# EAGLE design rita_milton_civ (EAGLE 9.6.2)
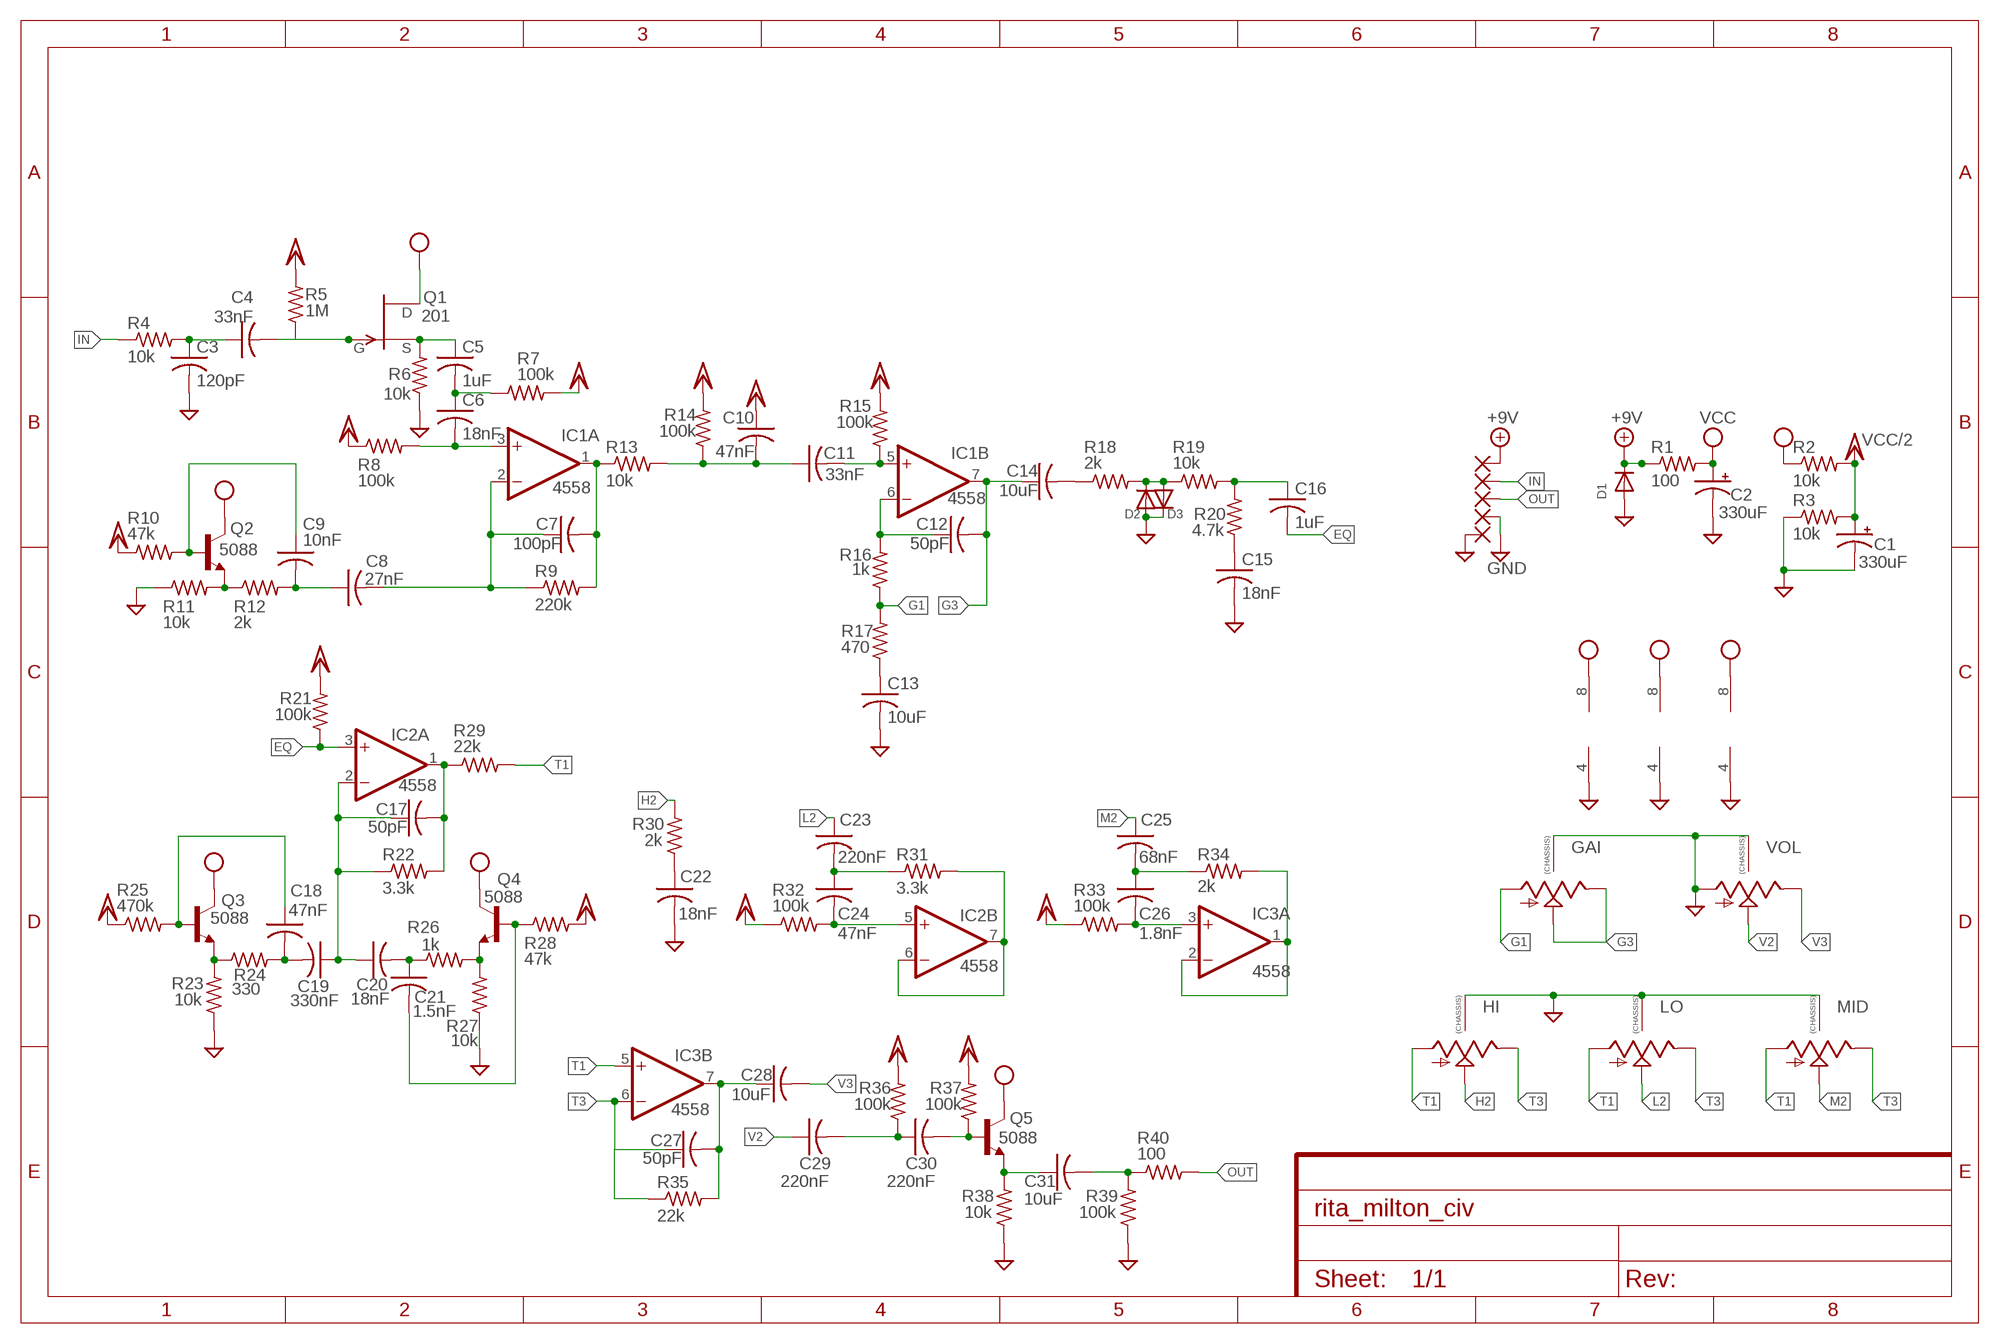
[diagram p0: schematic, sheet 1]

## Parts
C1  330uF  0801  [080_035]
C2  330uF  0801  [080_035]
C3  120pF  C-USC0603  [C0603]
C4  33nF  C-USC0603  [C0603]
C5  1uF  C-USC0805  [C0805]
C6  18nF  C-USC0603  [C0603]
C7  100pF  C-USC0603  [C0603]
C8  27nF  C-USC0603  [C0603]
C9  10nF  C-USC0603  [C0603]
C10  47nF  C-USC0603  [C0603]
C11  33nF  C-USC0603  [C0603]
C12  50pF  C-USC0603  [C0603]
C13  10uF  C-USC1206  [C1206]
C14  10uF  C-USC1206  [C1206]
C15  18nF  C-USC0603  [C0603]
C16  1uF  C-USC0805  [C0805]
C17  50pF  C-USC0603  [C0603]
C18  47nF  C-USC0603  [C0603]
C19  330nF  C-USC0603  [C0603]
C20  18nF  C-USC0603  [C0603]
C21  1.5nF  C-USC0603  [C0603]
C22  18nF  C-USC0603  [C0603]
C23  220nF  C-USC0603  [C0603]
C24  47nF  C-USC0603  [C0603]
C25  68nF  C-USC0603  [C0603]
C26  1.8nF  C-USC0603  [C0603]
C27  50pF  C-USC0603  [C0603]
C28  10uF  C-USC1206  [C1206]
C29  220nF  C-USC0603  [C0603]
C30  220nF  C-USC0603  [C0603]
C31  10uF  C-USC1206  [C1206]
D1  DIODESOD-123  [SOD-123]
D2  DIODESOD-123  [SOD-123]
D3  DIODESOD-123  [SOD-123]
GAI  9MM_SNAP-IN_POT_CHASSIS  [9MM_SNAP-IN_POT]
HI  9MM_SNAP-IN_POT_CHASSIS  [9MM_SNAP-IN_POT]
IC1  4558  LM4558D  [SO08]
IC2  4558  LM4558D  [SO08]
IC3  4558  LM4558D  [SO08]
LO  9MM_SNAP-IN_POT_CHASSIS  [9MM_SNAP-IN_POT]
MID  9MM_SNAP-IN_POT_CHASSIS  [9MM_SNAP-IN_POT]
PAD1  1,6/0,8  [1,6/0,8]
PAD2  1,6/0,8  [1,6/0,8]
PAD3  1,6/0,8  [1,6/0,8]
PAD4  1,6/0,8  [1,6/0,8]
PAD5  1,6/0,8  [1,6/0,8]
Q1  201  SST201  [SOT23]
Q2  5088  TRANSISTOR_NPNMMBT5088  [SOT23]
Q3  5088  TRANSISTOR_NPNMMBT5088  [SOT23]
Q4  5088  TRANSISTOR_NPNMMBT5088  [SOT23]
Q5  5088  TRANSISTOR_NPNMMBT5088  [SOT23]
R1  100  R-US_R0805  [R0805]
R2  10k  R-US_R0603  [R0603]
R3  10k  R-US_R0603  [R0603]
R4  10k  R-US_R0603  [R0603]
R5  1M  R-US_R0603  [R0603]
R6  10k  R-US_R0603  [R0603]
R7  100k  R-US_R0603  [R0603]
R8  100k  R-US_R0603  [R0603]
R9  220k  R-US_R0603  [R0603]
R10  47k  R-US_R0603  [R0603]
R11  10k  R-US_R0603  [R0603]
R12  2k  R-US_R0603  [R0603]
R13  10k  R-US_R0603  [R0603]
R14  100k  R-US_R0603  [R0603]
R15  100k  R-US_R0603  [R0603]
R16  1k  R-US_R0603  [R0603]
R17  470  R-US_R0603  [R0603]
R18  2k  R-US_R0603  [R0603]
R19  10k  R-US_R0603  [R0603]
R20  4.7k  R-US_R0603  [R0603]
R21  100k  R-US_R0603  [R0603]
R22  3.3k  R-US_R0603  [R0603]
R23  10k  R-US_R0603  [R0603]
R24  330  R-US_R0603  [R0603]
R25  470k  R-US_R0603  [R0603]
R26  1k  R-US_R0603  [R0603]
R27  10k  R-US_R0603  [R0603]
R28  47k  R-US_R0603  [R0603]
R29  22k  R-US_R0603  [R0603]
R30  2k  R-US_R0603  [R0603]
R31  3.3k  R-US_R0603  [R0603]
R32  100k  R-US_R0603  [R0603]
R33  100k  R-US_R0603  [R0603]
R34  2k  R-US_R0603  [R0603]
R35  22k  R-US_R0603  [R0603]
R36  100k  R-US_R0603  [R0603]
R37  100k  R-US_R0603  [R0603]
R38  10k  R-US_R0603  [R0603]
R39  100k  R-US_R0603  [R0603]
R40  100  R-US_R0603  [R0603]
VOL  9MM_SNAP-IN_POT_CHASSIS  [9MM_SNAP-IN_POT]

## Nets
+9V: D1.C PAD1.1(P) R1.1
EQ: C16.2 IC2.3(A:+IN) R21.1
G1: GAI.1(A) R16.1 R17.2
G3: C12.2 C14.1 GAI.2(S) GAI.3(E) IC1.7(B:OUT)
GND: C1.- C2.- C3.2 C13.2 C15.2 C22.2 D1.A D2.A D3.C GAI.CHASSIS1 GAI.CHASSIS2 HI.CHASSIS1 HI.CHASSIS2 IC1.4(P:V-) IC2.4(P:V-) IC3.4(P:V-) LO.CHASSIS1 LO.CHASSIS2 MID.CHASSIS1 MID.CHASSIS2 PAD4.1(P) PAD5.1(P) R3.1 R6.1 R11.1 R23.1 R27.1 R38.1 R39.1 VOL.1(A) VOL.CHASSIS1 VOL.CHASSIS2
H2: HI.2(S) R30.2
IN: PAD2.1(P) R4.1
L2: C23.1 LO.2(S)
M2: C25.1 MID.2(S)
N$1: C3.1 C4.1 R4.2
N$2: C4.2 Q1.3(G) R5.1
N$3: C5.1 Q1.2(S) R6.2
N$4: C5.2 C6.1 R7.1
N$5: C6.2 IC1.3(A:+IN) R8.2
N$6: C9.1 Q2.1(B) R10.2
N$7: Q2.2(E) R11.2 R12.1
N$8: C8.1 C9.2 R12.2
N$9: C7.1 C8.2 IC1.2(A:-IN) R9.1
N$10: C7.2 IC1.1(A:OUT) R9.2 R13.1
N$11: C10.2 C11.1 R13.2 R14.1
N$12: C11.2 IC1.5(B:+IN) R15.1
N$13: C12.1 IC1.6(B:-IN) R16.2
N$14: C14.2 R18.1
N$15: D2.C D3.A R18.2 R19.1
N$16: C13.1 R17.1
N$17: C17.1 C19.1 C20.1 IC2.2(A:-IN) R22.1
N$18: C16.1 R19.2 R20.2
N$19: C15.1 R20.1
N$20: C17.2 IC2.1(A:OUT) R22.2 R29.1
N$21: Q3.2(E) R23.2 R24.1
N$22: C18.2 C19.2 R24.2
N$23: C18.1 Q3.1(B) R25.2
N$24: C20.2 C21.1 R26.1
N$25: Q4.2(E) R26.2 R27.2
N$26: C21.2 Q4.1(B) R28.1
N$27: C22.1 R30.1
N$28: C23.2 C24.1 R31.1
N$29: C24.2 IC2.5(B:+IN) R32.2
N$30: IC2.6(B:-IN) IC2.7(B:OUT) R31.2
N$31: C25.2 C26.1 R34.1
N$32: C26.2 IC3.3(A:+IN) R33.2
N$33: IC3.1(A:OUT) IC3.2(A:-IN) R34.2
N$34: C27.2 C28.1 IC3.7(B:OUT) R35.2
N$35: C29.2 C30.1 R36.1
N$36: C30.2 Q5.1(B) R37.1
N$37: C31.1 Q5.2(E) R38.2
N$38: C31.2 R39.2 R40.1
OUT: PAD3.1(P) R40.2
T1: HI.1(A) IC3.5(B:+IN) LO.1(A) MID.1(A) R29.2
T3: C27.1 HI.3(E) IC3.6(B:-IN) LO.3(E) MID.3(E) R35.1
V2: C29.1 VOL.2(S)
V3: C28.2 VOL.3(E)
VCC: C2.+ IC1.8(P:V+) IC2.8(P:V+) IC3.8(P:V+) Q1.1(D) Q2.3(C) Q3.3(C) Q4.3(C) Q5.3(C) R1.2 R2.1
VCC/2: C1.+ C10.1 R2.2 R3.2 R5.2 R7.2 R8.1 R10.1 R14.2 R15.2 R21.2 R25.1 R28.2 R32.1 R33.1 R36.2 R37.2

## Library data of the parts
C1 C2 = capacitors-elec:080: 47 - 470uF Xicon values at Mouser.com 10V: 330, 470uF; 16V: 220, 330uF; 25V: 220uF; 50V: 47, 100uF
C3-C31 = adafruit:C-US: CAPACITOR, American symbol
D1-D3 = adafruit:DIODE: Diode SMADIODE - SMA Surface Mount Package 20V 1A Schottky Diode Digikey: 641-1014-6-ND DO-1N4148 - Through Hole Small Current Diode SOD-123 20V 1 A (.5mV Vf) Schottky Diode - Digikey: MBRX120TPMSCT-ND SOD-323 10V 570mA (.38mV Vf, 3ns) Schottky Diode - Digikey: ZLLS410CT-ND SOD-523 30V 30mA Schottky Diode (RB751S-40TE61) - Digikey: RB751S-40TE61CT-ND SOT23-R/W - SOT23 Package (R = Solder Paste/Reflow Ovens, W = Hand-Soldering) BAT54Film 40V 300mA - Digikey: 497-7162-1-ND
GAI HI LO MID VOL = MusicThingModular:9MM_SNAP-IN_POT_CHASSIS: 9mm vertical snap-in pot, Alpha / Panasonic style, with a connection to the metal chassis for grounding
IC1-IC3 = linear:*4558: OP AMP
PAD1-PAD5 = wirepad:1,6/0,8: THROUGH-HOLE PAD
Q1 = transistor-fet:?20*: TEMIC / Siliconix N-Channel JFET Source: JFET-J201_Siliconix_data.pdf
Q2-Q5 = SparkFun-DiscreteSemi:TRANSISTOR_NPN: Generic NPN BJT MMBT2222A - TRANS-08049 (SOT-23, 1A 40V) MPSA42 - TRANS-09116 (SOT-23, 500mA 300V) MMBT5088LT1G - TRANS-11160 (SOT-23, 50 mA 30V) BC547 - COM-08928 <http://www.sparkfun.com/products/8928> (TO-92 45V 100mA) (1.Collector 2.Base 3.Emitter) 2N3904 - COM-00521 <http://www.sparkfun.com/products/521> (TO-92 40V 200mA) (1.Emitter 2.Base 3.Collector) P2N2222A - COM-12852 <http://www.sparkfun.com/products/12852> (TO-92 40V 600mA) (1.Collector 2.Base 3.Emitter); PROD_ID: TRANS-11160; VALUE: MMBT5088
R1-R40 = adafruit:R-US_: RESISTOR, American symbol

## Board
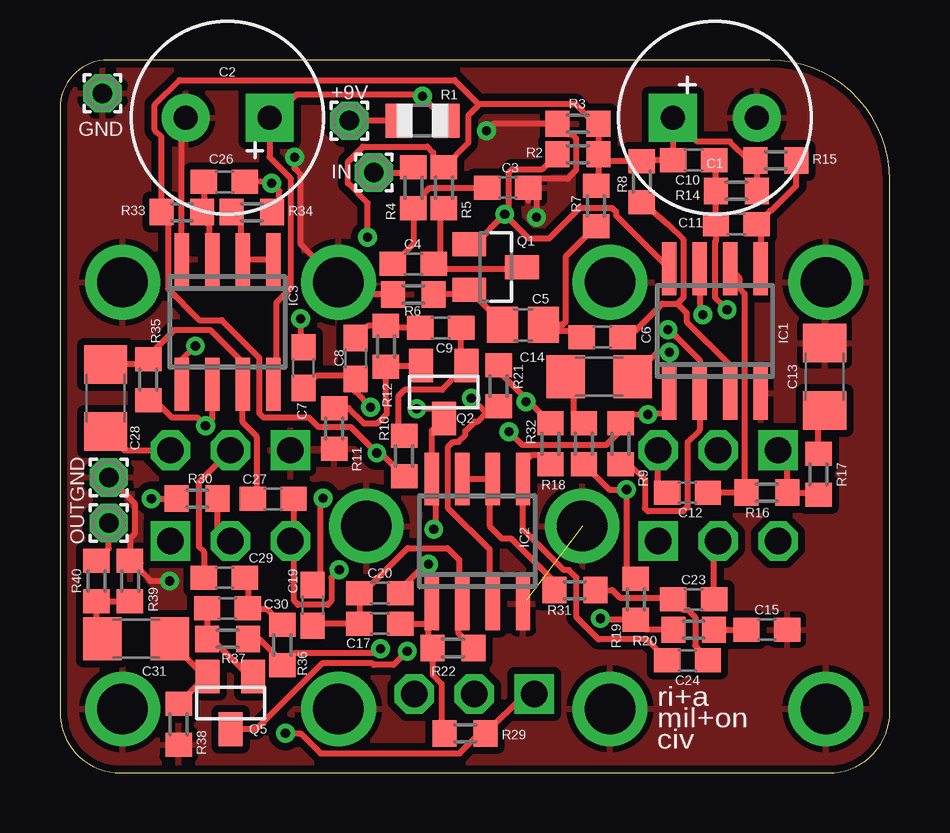
[diagram p1: board, top side]
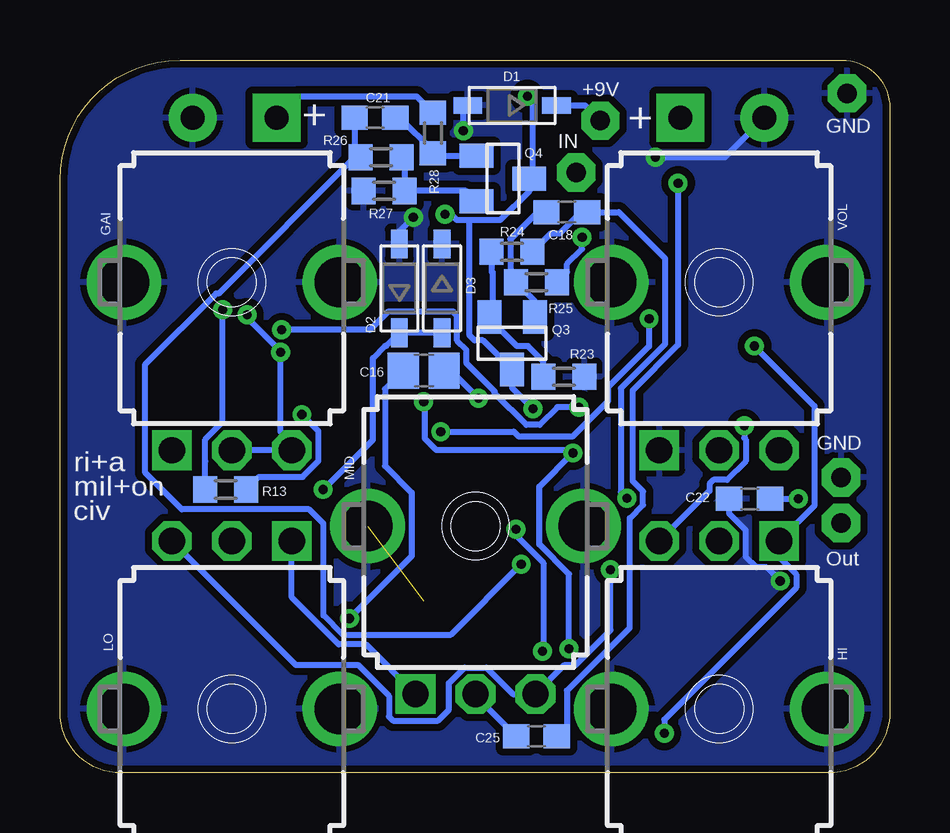
[diagram p2: board, bottom side, seen from below]

Size 34.59 x 29.71 mm. Coordinates in mm from the lower left corner, seen from the top.
Outline: 29.59,29.71 2,29.71 arc90 0,27.71 0,2.54 arc90 2.54,0 32.05,0 arc90 34.59,2.54 34.59,24.71 arc90 29.59,29.71
Copper layers (1*16): Top 0.035mm / dielectric 1.5mm / Bottom 0.035mm
Design rules "default *": minimum track width 6mil, minimum drill 0.35mm, track to track 6mil, track to pad 6mil, pad to pad 6mil, via to via 6mil, smd to smd 6mil, copper to edge 10mil, drill to drill 6mil, minimum pad ring 10mil, minimum via ring 8mil, stop-mask expansion 4mil, vias tented up to drill 0mil, thermal gap 10mil

### Footprints (pad centres in the part's own frame; a part is rotated, then mirrored left to right if it is on the bottom)
080_035 = drill 1 pad 2 square: + -1.75,0 | drill 1 pad 2: - 1.75,0
C0603 = smd 1.1 x 1: 1 -0.85,0; 2 0.85,0
C0805 = smd 1.3 x 1.5: 1 -0.85,0; 2 0.85,0
C1206 = smd 1.6 x 1.8: 1 -1.4,0; 2 1.4,0
SOD-123 = smd 1.2 x 0.7: A 1.85,0; C -1.85,0
9MM_SNAP-IN_POT = drill 1.1 square: 1 -2.5,-7 | drill 1.1 octagon: 2 0,-7; 3 2.5,-7 | drill 2.1 pad 2.794: CHASSIS1 -4.5,0; CHASSIS2 4.5,0
SO08 = smd 0.6 x 2.2: 1 -1.905,-2.6; 2 -0.635,-2.6; 3 0.635,-2.6; 4 1.905,-2.6; 5 1.905,2.6; 6 0.635,2.6; 7 -0.635,2.6; 8 -1.905,2.6
1,6/0,8 = drill 0.813 pad 1.6 octagon: 1 0,0
SOT23 = smd 1 x 1.4: 1 -0.95,-1.1; 2 0.95,-1.1; 3 0,1.1
R0805 = smd 1.1 x 1.4: 1 -1,0; 2 1,0
R0603 = smd 1 x 1.1: 1 -0.85,0; 2 0.85,0

### Placement (x,y rotation side)
C1  27.3,27.3 0 top
C2  6.99,27.3 180 top
C3  18.67,24.38 0 top
C4  14.73,21.21 0 top
C5  19.3,18.67 0 top
C6  22.61,18.16 0 top
C7  10.16,16.89 90 top
C8  12.32,17.27 270 top
C9  15.88,18.54 180 top
C10  26.42,25.53 0 top
C11  28.19,22.86 0 top
C12  26.16,11.68 180 top
C13  31.88,16.51 90 top
C14  22.48,16.51 180 top
C15  29.46,5.97 0 top
C16  19.43,16.76 0 bottom
C17  13.34,6.22 0 top
C18  13.46,23.37 0 bottom
C19  10.54,6.99 90 top
C20  13.34,7.49 0 top
C21  21.46,27.3 0 bottom
C22  5.84,11.43 180 bottom
C23  26.42,7.24 180 top
C24  26.16,4.7 180 top
C25  14.73,1.52 0 bottom
C26  6.86,24.64 180 top
C27  8.89,11.43 180 top
C28  1.91,15.62 270 top
C29  6.86,8.13 0 top
C30  6.99,6.86 180 top
C31  3.17,5.59 180 top
D1  15.75,27.81 180 bottom
D2  20.45,20.19 90 bottom
D3  18.67,20.19 270 bottom
GAI  27.43,20.45 0 bottom
HI  7.11,2.67 180 bottom
IC1  27.3,18.41 0 top
IC2  17.4,9.65 0 top
IC3  6.99,18.8 180 top
LO  27.43,2.67 180 bottom
MID  17.27,10.29 0 bottom
PAD1  12.06,27.18 0 top
PAD2  13.08,25.02 0 top
PAD3  2.03,10.41 0 top
PAD4  1.78,28.32 0 top
PAD5  2.03,12.32 0 top
Q1  18.16,21.08 270 top
Q2  16,15.88 180 top
Q3  15.75,17.91 180 bottom
Q4  16.13,24.77 270 bottom
Q5  7.11,2.92 180 top
R1  15.11,27.18 0 top
R2  21.59,25.78 0 top
R3  21.59,27.05 0 top
R4  14.73,24.38 270 top
R5  16,24.38 90 top
R6  14.73,19.94 0 top
R7  22.35,23.62 90 top
R8  24.26,24.64 270 top
R9  23.37,13.72 90 top
R10  14.35,13.21 90 top
R11  11.43,14.35 90 top
R12  13.59,17.78 90 top
R13  27.69,11.81 180 bottom
R14  28.19,24.26 0 top
R15  29.84,25.53 180 top
R16  29.46,11.68 180 top
R17  31.62,12.45 270 top
R18  21.84,13.72 270 top
R19  24,7.24 270 top
R20  26.42,5.97 180 top
R21  18.29,16.13 90 top
R22  16.38,5.21 180 top
R23  13.59,16.51 180 bottom
R24  15.75,21.72 0 bottom
R25  14.73,20.45 180 bottom
R26  21.21,25.65 0 bottom
R27  21.08,24.26 0 bottom
R28  19.05,26.67 90 bottom
R29  16.89,1.65 0 top
R30  5.71,11.43 0 top
R31  21.46,7.62 180 top
R32  20.45,13.72 270 top
R33  5.08,23.37 0 top
R34  8,23.37 180 top
R35  3.68,16.38 90 top
R36  9.27,5.33 270 top
R37  6.99,5.59 0 top
R38  4.95,2.03 90 top
R39  2.92,8 270 top
R40  1.52,8 90 top
VOL  7.11,20.45 0 bottom

### Tracks (layer width: path | path; a pad name or v marks a point on that pad's centre or on a via)
+9V
  Top 0.254: R1.1 PAD1.1
  Bottom 0.254: PAD1.1 12.7,27.81 D1.C
EQ  (via drill 0.38)
  Top 0.254: IC2.3 17.91,7.18 17.91,9.31 16.18,11.04 16.18,13.6 16.39,13.8 16.62,13.8 16.9,14.08 16.9,14.25 17.3,14.64 17.4,14.64 17.78,15.03 | R21.1 18.03,15.28 17.78,15.03 | 17.78,15.03 17.74,15.03 v17.14,15.62
  Bottom 0.254: C16.2 18.29,16.76 v17.14,15.62
G1
  Top 0.254: GAI.1 30.31,13.06 R16.1 31.54,11.68 R17.2
G3  (via drill 0.38)
  Top 0.254: C12.2 24.93,12.06 GAI.3 | v26.8,19.09 26.67,19.21 IC1.7 | C14.1 24.89,17.53 v25.4,17.53
  Bottom 0.254: GAI.2 GAI.3 24.93,13.77 25.4,14.24 v25.4,17.53 25.4,17.56 26.8,18.96 v26.8,19.09
GND  (via drill 0.38)  (1 unrouted)
  Top 0.254: C3.2 19.52,23.86 | VOL.1 9.67,13.5 | PAD5.1 3.11,11.24 3.11,9.97 2.92,9.78 R39.1 3.77,8 v4.57,8 | IC2.4 19.43,7.18 | C3.2 19.89,24.76 21.16,24.76 21.52,25.11 21.52,26.45 21.36,26.61 21.18,26.61 R3.1 18.07,27.05 v17.78,26.76 | IC3.4 5.08,27.15 C2.- | R6.1 12.12,19.94 VOL.CHASSIS1 10.04,22.02 10.04,24.93 9.78,25.19 v9.78,25.65 | C3.2 19.86,24.04 v19.86,23.16
  Bottom 0.254: v4.57,8 5.13,8.56 5.55,8.56 6.01,9.02 6.01,10.12 6.69,10.81 C22.2 | v17.78,26.76 17.78,27.63 D1.A | v19.86,23.16 20.45,22.58 D2.A | v9.78,25.65 6.89,25.65 C2.-
  pour Bottom (isolate 0.305): -1.91,-1.91 37.47,-1.91 37.47,31.11 -1.91,31.11
  pour Top (isolate 0.305): -1.91,-1.91 37.47,-1.91 37.47,31.11 -1.91,31.11
H2
  Top 0.254: HI.2 6.57,10.21 R30.2
IN
  Top 0.254: PAD2.1 14.52,25.02 R4.1
L2
  Top 0.254: C23.1 27.27,9.5 LO.2
M2
  Bottom 0.254: C25.1 17.27,3.21 MID.2
N$1
  Top 0.254: C4.1 14.73,22.06 R4.2 15.17,23.98 15.17,24.15 15.41,24.38 C3.1
N$2
  Top 0.254: R5.1 15.84,23.37 15.84,21.46 C4.2 15.79,21 19.18,21 Q1.3
N$3
  Top 0.254: C5.1 18.45,18.74 Q1.2 16.87,19.94 R6.2
N$4
  Top 0.254: C6.1 21.5,18.41 20.7,18.41 20.95,18.67 | 20.95,18.67 C5.2 | R7.1 21.08,21.5 21.08,18.8 20.95,18.67
N$5
  Top 0.254: C6.2 23.71,18.16 25.11,19.56 25.74,19.56 | R8.2 25.36,22.85 25.98,22.23 25.98,19.8 25.74,19.56 | 25.74,19.56 26.12,19.17 26.12,18.81 27.94,16.99 IC1.3
N$6
  Top 0.254: C9.1 16.73,17.2 Q2.1 15.94,15.96 14.36,15.96 14.1,15.7 14.1,14.31 R10.2
N$7
  Top 0.254: Q2.2 13.63,16.98 R12.1 13.59,15.56 13.63,15.52 13.63,14.96 13.23,14.57 12.68,14.57 12.04,15.2 R11.2
N$8
  Top 0.254: C9.2 13.68,18.54 R12.2 12.83,18.63 C8.1
N$9  (via drill 0.38)
  Top 0.254: R9.1 23.75,12.87 24.38,12.23 24.38,11.04 24.52,10.9 25.98,10.9 26.16,11.09 26.16,13.78 26.67,14.29 IC1.2 26.67,17.21 25.68,18.2 25.62,18.2 v25.35,18.47 | C7.1 10.67,16.55 12.19,16.55 C8.2 12.32,15.88 v12.95,15.24
  Bottom 0.254: v12.95,15.24 13.86,15.24 14.6,14.5 15.15,14.5 16.47,15.82 16.47,15.9 17.65,17.08 17.65,17.63 18.04,18.02 18.04,19.06 18.2,19.22 20.91,19.22 21.67,18.47 v25.35,18.47
N$10  (via drill 0.38)
  Top 0.254: IC1.1 25.4,15.24 25.15,14.99 24.56,14.99 v24.51,14.94 23.74,14.94 R9.2 23.37,14.26 22.76,13.66 19.28,13.66 v18.72,14.22 | v10.03,18.92 10.03,17.87 C7.2
  Bottom 0.254: R13.1 26.3,12.34 24.48,12.34 23.83,12.99 23.83,14.25 v24.51,14.94 | v10.03,18.92 10.03,17.78 11.74,16.07 11.74,15.5 13.21,14.03 15.47,14.03 15.67,14.22 v18.72,14.22
N$11  (via drill 0.38)
  Top 0.254: v27.81,19.3 27.3,19.81 27.3,22.14 27.34,22.18 C11.1 R14.1 27.34,25.45 C10.2
  Bottom 0.254: R13.2 28.54,12.99 28.54,13.9 27.81,14.63 v27.81,19.3
N$12
  Top 0.254: R15.1 30.7,24.46 29.66,23.43 29.61,23.43 C11.2 29.21,22.69 IC1.5
N$13
  Top 0.254: C12.1 R16.2 28.54,11.76 28.54,19.98 28.32,20.19 28.32,20.63 IC1.6
N$14
  Top 0.254: R18.1 21.4,15.01 21.4,15.94 21.08,16.27 C14.2
N$15  (via drill 0.38)
  Top 0.254: R18.2 22.9,11.81 v23.62,11.81 23.61,11.8 23.61,8.48 R19.1
  Bottom 0.254: D3.A D2.C 21,17.79 21.05,17.79 21.55,17.29 21.55,13.88 v23.62,11.81
N$16
  Top 0.254: R17.1 31.62,14.86 C13.1
N$17
  Top 0.254: R22.1 16.6,5.84 16.6,6.89 IC2.2 16.64,7.18 16.64,8.89 16.16,9.37 14.49,9.37 12.61,7.49 C20.1 C17.1 10.63,6.22 C19.1
N$18  (via drill 0.38)
  Top 0.254: R20.2 24.42,5.97 R19.2 22.53,6.39 v22.53,6.44
  Bottom 0.254: C16.1 21.04,16 21.04,12.79 19.93,11.68 19.93,9.03 v22.53,6.44
N$19
  Top 0.254: R20.1 C15.1
N$20
  Top 0.254: 15.37,6.22 15.37,5.37 R22.2 15.53,4.09 15.91,3.71 15.91,1.78 R29.1 | IC2.1 15.49,6.22 15.37,6.22 | C17.2 15.37,6.22
N$21
  Bottom 0.254: 16.64,18.88 16.57,18.88 16.57,20.9 16.6,20.88 R24.1 | Q3.2 16.76,19.01 16.64,18.88 | R23.2 14.44,17.14 15.08,17.79 15.54,17.79 16.64,18.88
N$22  (via drill 0.38)
  Top 0.254: v10.96,11.45 10.84,11.33 10.84,8.13 C19.2
  Bottom 0.254: R24.2 14.14,22.48 13.76,22.48 12.87,23.37 C18.2 11.3,23.37 9.36,21.43 9.36,17.88 11.22,16.02 11.22,11.71 v10.96,11.45
N$23
  Bottom 0.254: C18.1 14.69,23.37 15.82,22.24 15.82,20.68 R25.2 14.8,19.66 Q3.1
N$24  (via drill 0.38)
  Top 0.254: C20.2 14.19,7.64 15.24,8.7 v15.37,8.7
  Bottom 0.254: v15.37,8.7 18.3,5.77 22.81,5.77 23.61,6.57 23.61,10.39 24.2,10.98 29.51,10.98 31.04,12.51 31.04,17.03 28.09,19.98 27.99,19.98 22.31,25.65 R26.1 22.31,25.91 C21.1
N$25
  Bottom 0.254: Q4.2 17.67,24.26 R27.2 20.23,25.53 R26.2
N$26
  Bottom 0.254: Q4.1 18.95,25.71 R28.1 19.05,25.92 20.44,27.3 C21.2
N$27  (via drill 0.38)
  Top 0.254: v3.81,11.43 R30.1
  Bottom 0.254: C22.1 v3.81,11.43
N$28
  Top 0.254: C24.1 26.5,5.29 26.49,5.3 26.49,6.49 26.18,6.8 26.01,6.8 C23.2 25.5,7.31 23.34,7.31 23.03,7.62 R31.1
N$29
  Top 0.254: R32.2 20.07,13.25 19.66,13.25 19.3,12.89 IC2.5 19.3,10.16 21.01,8.45 21.23,8.45 21.53,8.14 21.53,6.48 22.45,5.56 24.45,5.56 C24.2
N$30
  Top 0.254: IC2.7 IC2.6 17.91,12.12 17.91,10.29 18.41,9.78 18.8,9.78 20.57,8 R31.2
N$31  (via drill 0.38)
  Top 0.254: R34.1 9.14,23.66 9.14,24.26 v8.83,24.57 8.76,24.64 C26.1
  Bottom 0.254: v8.83,24.57 8.83,17.84 10.72,15.95 10.72,12.16 10.29,11.73 10.29,11.18 10.84,10.62 10.84,6.05 13.46,3.43 13.46,1.94 C25.2
N$32
  Top 0.254: C26.2 6.01,23.45 R33.2 5.93,23.11 6.22,22.82 6.22,21.52 IC3.3
N$33
  Top 0.254: R34.2 7.53,22.99 7.53,21.48 IC3.2 IC3.1
N$34
  Top 0.254: C28.1 3.47,17.02 R35.2 3.68,17.36 4.79,18.46 6.26,18.46 7.56,17.16 7.56,16.25 IC3.7 7.62,14.61 8.22,14.01 8.22,11.72 8.04,11.54 C27.2
N$35
  Top 0.254: C29.2 7.83,8 C30.1 7.87,6.82 8.64,6.82 R36.1
N$36
  Top 0.254: C30.2 R37.1 6.32,5.59 7.88,4.02 Q5.1
N$37
  Top 0.254: C31.1 4.53,5.54 6.04,4.02 Q5.2 6.09,4.02 R38.2
N$38
  Top 0.254: C31.2 1.52,5.84 R40.1 R39.2
OUT
  Top 0.254: R40.2 2.03,9.36 PAD3.1
T1  (via drill 0.38)
  Top 0.254: IC3.5 5.08,17.23 v5.65,17.79 | MID.1 19.38,3.29 R29.2 17.49,1.65 16.66,0.82 10.86,0.82 10.03,1.65 v9.4,1.65
  Bottom 0.254: v5.65,17.79 3.14,15.28 3.14,11.14 HI.1 4.61,8.99 3.9,8.28 3.9,7.72 9.4,2.22 v9.4,1.65 | MID.1 21.84,5.36 22.98,5.36 24.93,7.31 LO.1
T3  (via drill 0.38)
  Top 0.254: C27.1 9.74,9.79 HI.3 9.76,9.52 9.76,7.17 9.93,7.01 11.16,7.01 11.32,7.17 11.32,8.15 v11.64,8.47 | R35.1 3.95,15.53 4.66,14.82 5.71,14.82 v6.07,14.47 6.35,14.75 IC3.6
  Bottom 0.254: v6.07,14.47 6.07,13.96 6.01,13.9 6.01,12.99 6.79,12.21 7.36,12.21 7.52,12.05 7.52,11.76 HI.3 | LO.3 24.77,4.5 22.17,4.5 20.88,3.21 20.88,2.35 20.71,2.18 18.83,2.18 18.38,2.64 18.38,3.74 17.73,4.39 16.82,4.39 15.71,3.29 MID.3 13.55,4.5 13.09,4.5 11.64,5.95 v11.64,8.47
V2
  Top 0.254: C29.1 6.01,9.21 5.79,9.43 5.79,12.12 VOL.2
V3
  Top 0.254: C28.2 2.68,13.45 VOL.3
VCC  (via drill 0.38)
  Top 0.254: IC3.8 9.02,16.32 9.02,19.6 9.63,20.21 9.63,24.77 8.73,25.66 C2.+ 8.89,27.3 9.84,28.26 15.05,28.26 v15.11,28.19 15.11,28.18 R1.2 | Q1.1 17.3,22.03 v18.54,23.28 | v14.88,15.18 15.6,15.18 Q2.3 15.49,14.27 IC2.8 15.65,12.1 15.65,10.22 v15.58,10.15 | v18.54,23.28 18.69,23.43 18.69,25 18.85,25.16 20.12,25.16 R2.1 | IC1.8 23.18,23.23 23.18,23.39 23.02,23.55 21.69,23.55 20.4,22.26 19.56,22.26 v18.54,23.28 | v14.48,5.08 13.9,4.5 13.09,4.5 13.02,4.57 10.92,4.57 8.17,1.82 Q5.3
  Bottom 0.254: v14.88,15.18 15.75,16.05 Q3.3 16.97,18.03 17.31,18.03 17.53,18.24 17.53,23.04 | v15.11,28.19 14.9,27.98 14.9,24.89 Q4.3 15.03,24.25 16.24,23.04 17.53,23.04 | v15.58,10.15 15.58,9.9 14.44,8.75 14.44,5.12 v14.48,5.08 | v18.54,23.28 18.29,23.28 18.05,23.04 17.53,23.04
VCC/2  (via drill 0.38)
  Top 0.254: R37.2 8.29,5.59 9.27,4.61 R36.2 9.78,4.99 13.18,4.99 v13.37,5.18 | 25.57,27.29 C10.1 24.3,25.53 R8.1 22.61,25.49 22.44,25.65 | 25.57,27.29 C1.+ | 25.57,27.29 26.55,26.31 27.93,26.31 28.71,25.53 R15.2 29.04,25.48 R14.2 | R32.1 19.55,15.47 v19.43,15.47 19.43,15.6 18.29,16.74 R21.2 | 17.5,27.88 17.02,27.39 17.02,26.25 R5.2 15.56,25.68 15.56,25.85 15.31,26.1 12.63,26.1 12,25.47 12,24.57 12.83,23.75 v12.83,22.32 | 17.5,27.88 21.48,27.88 22.31,27.05 R3.2 R2.2 22.44,25.65 | 17.5,27.88 17.44,27.88 16.45,28.87 4.99,28.87 3.96,27.84 3.96,26.77 4.23,26.5 R33.1 4.5,23.1 4.5,20.18 5.81,18.87 6.74,18.87 8.31,17.3 8.31,14.98 8.47,14.82 10.37,14.82 10.76,14.42 12.12,14.42 v13.21,13.34 13.37,13.34 R10.1 | 22.44,25.65 22.44,24.56 R7.2
  Bottom 0.254: R28.2 19.72,28.19 24.67,28.19 C1.+ | v19.43,15.47 19.39,15.47 19.39,13.95 18.91,13.46 13.34,13.46 v13.21,13.34 14.61,11.93 14.61,9.53 13.37,8.29 v13.37,5.18 | R25.1 13.45,20.88 13.45,21.21 12.83,21.83 v12.83,22.32

### Text on the board
tPlace: +9V | GND | IN | GND | OUT | ri+a | mil+on | civ
bPlace: +9V | GND | + | + | IN | GND | ri+a | mil+on | civ | Out